# Altium schematic sheet I2C_Subsystems.SchDoc
size A4; Organization: UltraZohm; SheetNumber: 14
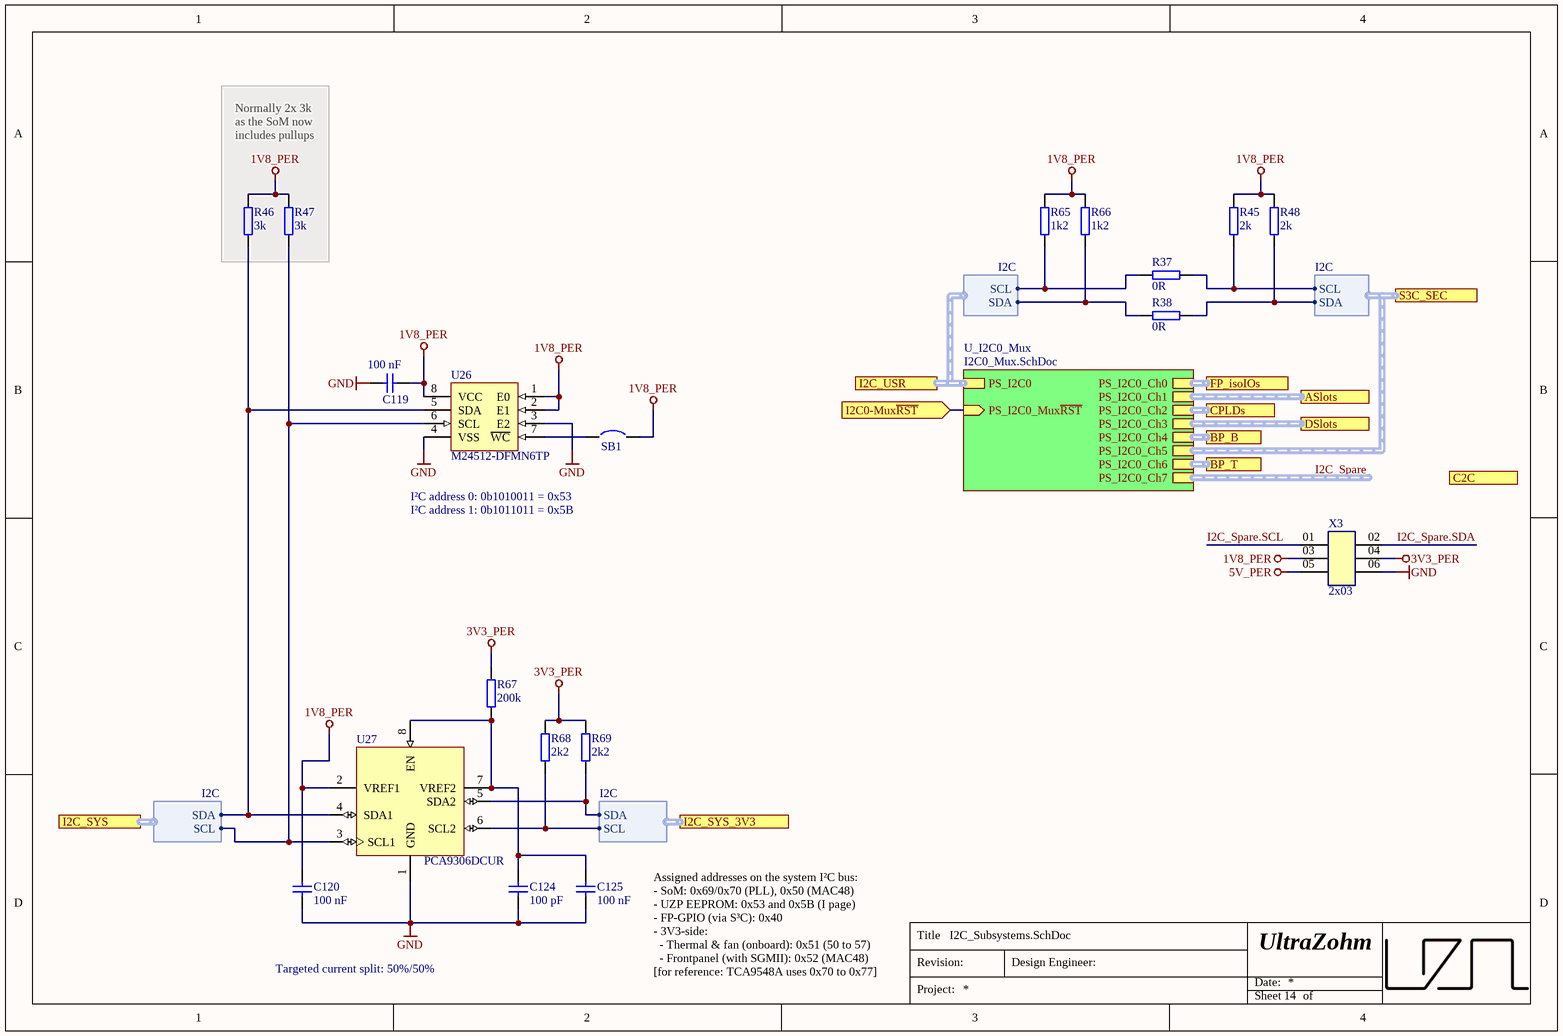
[diagram p0: I2C_Subsystems.SchDoc]

## Parts
C119  100 nF  [C_0603_TE]
C120  100 nF  [C_0603_TE]
C124  100 pF  [C_0603_TE]
C125  100 nF  [C_0603_TE]
R37  0R  [R_0603_TE]
R38  0R  [R_0603_TE]
R45  2k  [R_0603_TE]
R46  3k  [R_0603_TE]
R47  3k  [R_0603_TE]
R48  2k  [R_0603_TE]
R65  1k2  [R_0603_TE]
R66  1k2  [R_0603_TE]
R67  200k  [R_0603_TE]
R68  2k2  [R_0603_TE]
R69  2k2  [R_0603_TE]
SB1  Solder Bump 0603  [SB_0603]  (value not drawn)  (no BOM)
U26  M24512-DFMN6TP  [D0008A_N]
U27  PCA9306DCUR  [FP-DCU0008A-IPC_B]
X3  Pin Layout: 2x03  [TSM-103-01-L-DV]  (hidden comment: PH 0.1" SMD 2x03)

## Sub-sheets
U_I2C0_Mux = I2C0_Mux.SchDoc: PS_I2C0 (harness I2C), PS_I2C0_Mux~{RST} (in), PS_I2C0_Ch0 (harness I2C), PS_I2C0_Ch1 (harness I2C), PS_I2C0_Ch2 (harness I2C), PS_I2C0_Ch3 (harness I2C), PS_I2C0_Ch4 (harness I2C), PS_I2C0_Ch5 (harness I2C), PS_I2C0_Ch6 (harness I2C), PS_I2C0_Ch7 (harness I2C)

## Ports
ASlots (harness I2C), BP_B (harness I2C), BP_T (harness I2C), C2C (harness I2C), CPLDs (harness I2C), DSlots (harness I2C), FP_isoIOs (harness I2C), I2C0-Mux~{RST} (in), I2C_SYS (harness I2C), I2C_SYS_3V3 (harness I2C), I2C_USR (harness I2C), S3C_SEC (harness I2C)

## Harnesses
I2C: SCL, SDA

## Nets
1V8_PER: C119.2 C120.2 R45.2 R46.2 R47.2 R48.2 R65.2 R66.2 SB1.2 U26.1(E0) U26.2(E1) U26.8(VCC) U27.2(VREF1) X3.03
3V3_PER: R67.2 R68.2 R69.2 X3.04
5V_PER: X3.05
GND: C119.1 C120.1 C124.1 C125.1 U26.3(E2) U26.4(VSS) U27.1(GND) X3.06
I2C0-Mux~{RST}: port I2C0-Mux~{RST}, sheet U_I2C0_Mux/PS_I2C0_Mux~{RST}
I2C_Spare.SCL: X3.01
I2C_Spare.SDA: X3.02
NetC124_2: C124.2 C125.2 R67.1 U27.7(VREF2) U27.8(EN)
NetR37_1: R37.1 R65.1 ; port I2C_USR.SCL
NetR37_2: R37.2 R45.1 ; port S3C_SEC.SCL
NetR38_1: R38.1 R66.1 ; port I2C_USR.SDA
NetR38_2: R38.2 R48.1 ; port S3C_SEC.SDA
NetR46_1: R46.1 U26.5(SDA) U27.4(SDA1) ; port I2C_SYS.SDA
NetR47_1: R47.1 U26.6(SCL) U27.3(SCL1) ; port I2C_SYS.SCL
NetR68_1: R68.1 U27.6(SCL2) ; port I2C_SYS_3V3.SCL
NetR69_1: R69.1 U27.5(SDA2) ; port I2C_SYS_3V3.SDA
NetSB1_1: SB1.1 U26.7(~{WC})

## Buses and harness runs
harness I2C_Spare = sheet U_I2C0_Mux/PS_I2C0_Ch7
harness port ASlots = sheet U_I2C0_Mux/PS_I2C0_Ch1
harness port BP_B = sheet U_I2C0_Mux/PS_I2C0_Ch4
harness port BP_T = sheet U_I2C0_Mux/PS_I2C0_Ch6
harness port CPLDs = sheet U_I2C0_Mux/PS_I2C0_Ch2
harness port DSlots = sheet U_I2C0_Mux/PS_I2C0_Ch3
harness port FP_isoIOs = sheet U_I2C0_Mux/PS_I2C0_Ch0
harness port I2C_USR = sheet U_I2C0_Mux/PS_I2C0
harness port S3C_SEC = sheet U_I2C0_Mux/PS_I2C0_Ch5

## Notes on the sheet
- Normally 2x 3k as the SoM now includes pullups
- I²C address 0: 0b1010011 = 0x53
- I²C address 1: 0b1011011 = 0x5B
- Targeted current split: 50%/50%
- Assigned addresses on the system I²C bus:
  - SoM: 0x69/0x70 (PLL), 0x50 (MAC48)
  - UZP EEPROM: 0x53 and 0x5B (I page)
  - FP-GPIO (via S³C): 0x40
  - 3V3-side:
  - Thermal & fan (onboard): 0x51 (50 to 57)
  - Frontpanel (with SGMII): 0x52 (MAC48)
  [for reference: TCA9548A uses 0x70 to 0x77]
- Title
- Revision:
- Design Engineer:
- Date:
- Project:
- Sheet
- of

## Library data of the parts
C119 C120 C125 = UZgen_C_0603_100nF_50V_X7R: Generic capacitor; Manufacturer: UZgen; Voltage: 50V; Tolerance: 10 %; Created from: AGeiger; Manufacturer Part Number: UZgen_C_0603_100nF_50V_X7R; PartID: 1; Created On: 02/07/2024 14:42:23; Value: 100 nF; Device Package: 0603; Technology: X7R; Mounting Type: SMD; Last Updated: 08/08/2024 15:01:15
C124 = UZgen_C_0603_100pF_50V_X7R: Generic capacitor; Manufacturer: UZgen; Voltage: 50V; Tolerance: 10 %; Created from: UZgenTool; Manufacturer Part Number: UZgen_C_0603_100pF_50V_X7R; PartID: 4215; Created On: 02/08/2024 11:18:08; Value: 100 pF; Device Package: 0603; Technology: X7R; Mounting Type: SMD; Last Updated: 02/08/2024 11:18:08
R37 R38 = UZgen_R_0603_0R: Generic resistor; Manufacturer: UZgen; Tolerance: 1 %; Created from: UZgenTool; Manufacturer Part Number: UZgen_R_0603_0R; PartID: 581; Created On: 08/07/2024 14:34:30; Value: 0R; Device Package: 0603; Mounting Type: SMD; Last Updated: 08/07/2024 14:34:30
R45 R48 = UZgen_R_0603_2k: Generic resistor; Manufacturer: UZgen; Tolerance: 1 %; Created from: UZgenTool; Manufacturer Part Number: UZgen_R_0603_2k; PartID: 228; Created On: 02/07/2024 17:29:49; Value: 2k; Device Package: 0603; Mounting Type: SMD; Last Updated: 02/07/2024 17:29:49
R46 R47 = UZgen_R_0603_3k: Generic resistor; Manufacturer: UZgen; Tolerance: 1 %; Created from: UZgenTool; Manufacturer Part Number: UZgen_R_0603_3k; PartID: 232; Created On: 02/07/2024 17:29:49; Value: 3k; Device Package: 0603; Mounting Type: SMD; Last Updated: 02/07/2024 17:29:49
R65 R66 = UZgen_R_0603_1k2: Generic resistor; Manufacturer: UZgen; Tolerance: 1 %; Created from: UZgenTool; Manufacturer Part Number: UZgen_R_0603_1k2; PartID: 223; Created On: 02/07/2024 17:29:49; Value: 1k2; Device Package: 0603; Mounting Type: SMD; Last Updated: 02/07/2024 17:29:49
R67 = UZgen_R_0603_200k: Generic resistor; Manufacturer: UZgen; Tolerance: 1 %; Created from: UZgenTool; Manufacturer Part Number: UZgen_R_0603_200k; PartID: 275; Created On: 02/07/2024 17:29:50; Value: 200k; Device Package: 0603; Mounting Type: SMD; Last Updated: 02/07/2024 17:29:50
R68 R69 = UZgen_R_0603_2k2: Generic resistor; Manufacturer: UZgen; Tolerance: 1 %; Created from: UZgenTool; Manufacturer Part Number: UZgen_R_0603_2k2; PartID: 229; Created On: 02/07/2024 17:29:49; Value: 2k2; Device Package: 0603; Mounting Type: SMD; Last Updated: 02/07/2024 17:29:49
SB1 = =Value: Created from: AGeiger; Revision: July-2002: Re-released for DXP Platform.; Manufacturer Part Number: Solder Bump 0603; PartID: 1; Created On: 09/01/2024 17:13:56; Component Type: Solder Bump; Device Package: 0603; Last Updated: 09/01/2024 17:13:56; Mounting Type: SMD; Value: Solder Bump 0603
U26 = M24512-DFMN6TP: 512Kbit 1MHz I2C SOP-8 EEPROM ROHS; Manufacturer: STMicroelectronics; Created from: FRosner; Manufacturer Part Number: M24512-DFMN6TP; PartID: 6; Created On: 07/09/2024 12:11:36; ComponentLink1Description: Datasheet; ComponentLink1URL: https://wmsc.lcsc.com/wmsc/upload/file/pdf/v2/lcsc/2304140030_STMicroelectronics-M24512-DFMN6TP_C222090.pdf; Component Type: EEPROM; Device Package: SOP-8; Last Updated: 07/09/2024 12:18:21; Mounting Type: SMD; Operating Temperature: -40 to +85 °C; Series: M24xxx; Supplier 1: Mouser; Supplier Part Number 1: 511-M24512-DFMN6TP; Supplier 2: LCSC; Supplier Part Number 2: C222090; Type: Memory; Value: M24512-DFMN6TP; LCSC Part Number: C222090
U27 = PCA9306DCUR: Translation - Voltage Levels Dual BiDir I2C-Bus & SMBus Vltg Lvl-Trans; Manufacturer: Texas Instruments; Created from: FRosner; Manufacturer Part Number: PCA9306DCUR; PartID: 3; Created On: 28/06/2024 14:17:50; ComponentLink1Description: Datasheet; ComponentLink1URL: https://www.ti.com/lit/ds/symlink/pca9306.pdf?ts=1719580405392&ref_url=https%253A%252F%252Fwww.mouser.de%252F; Component Type: Translation - Voltage Levels; Device Package: VSSOP-8; Last Updated: 11/07/2024 13:33:56; Mounting Type: SMD; Supplier 1: Mouser; Supplier Part Number 1: 595-PCA9306DCUR; Supplier 2: LCSC; Supplier Part Number 2: C33196; Type: Bidirectional Voltage Level Translator; Live Cycle Status: 1; LCSC Part Number: C33196; Stock number: not stored
X3 = UZgen_Conn_PinHead_2x03_SMD_100mil_90deg: 0.1" Double-row Pin Header, 90°-to-PCB SMD, 2x03 Pins, 250V, 3A; Manufacturer: UZgen; Pin Pitch: 0.1" x 0.1"; Pin Orientation: 90° (standing); Created from: UZgenTool; Manufacturer Part Number: UZgen_Conn_PinHead_2x03_SMD_100mil_90deg; PartID: 2; Created On: 18/02/2025 11:27:30; Value: PH 0.1" SMD 2x03; Device Package: SMD 0.1" 2x03; Pin Count: 6; Pin Voltage: 250V; Pin Current: 3A; Mounting Type: SMD; Last Updated: 18/02/2025 11:27:30